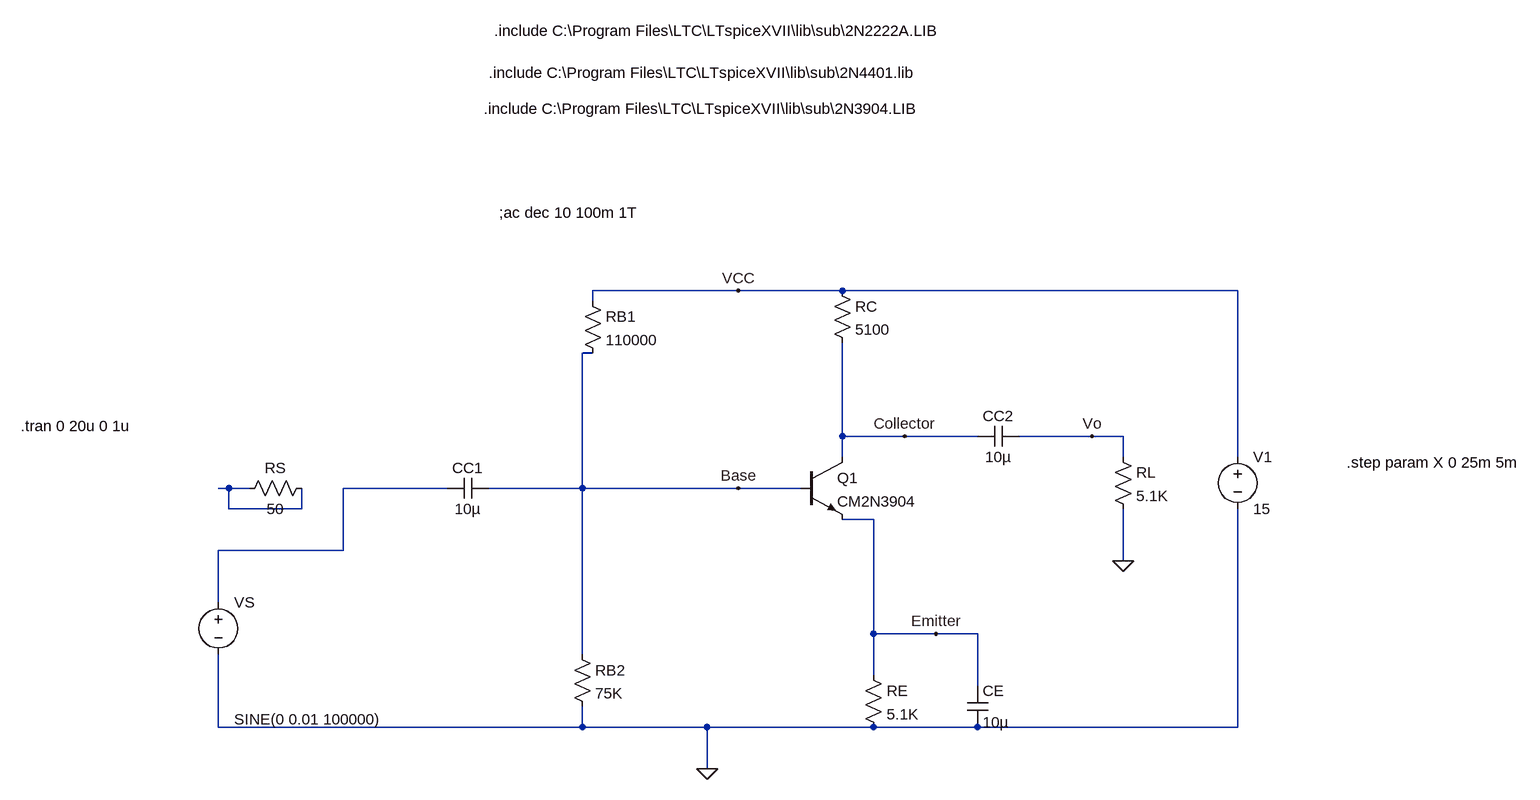
[diagram p0: schematic temp.asc]
temp.asc, the LTspice schematic file:
Version 4
SHEET 1 3216 804
WIRE 288 -16 64 -16
WIRE 448 -16 288 -16
WIRE 1056 -16 448 -16
WIRE 64 0 64 -16
WIRE 64 80 48 80
WIRE 448 208 448 64
WIRE 544 208 448 208
WIRE 656 208 544 208
WIRE 832 208 720 208
WIRE 880 208 832 208
WIRE 448 240 448 208
WIRE 880 240 880 208
WIRE 1056 240 1056 -16
WIRE -496 288 -512 288
WIRE -464 288 -496 288
WIRE -160 288 -320 288
WIRE 48 288 48 80
WIRE 48 288 -96 288
WIRE 288 288 48 288
WIRE 384 288 288 288
WIRE -496 320 -496 288
WIRE -384 320 -384 288
WIRE -384 320 -496 320
WIRE 496 336 448 336
WIRE -320 384 -320 288
WIRE -320 384 -512 384
WIRE 880 400 880 320
WIRE -512 464 -512 384
WIRE 496 512 496 336
WIRE 592 512 496 512
WIRE 656 512 592 512
WIRE 48 544 48 288
WIRE 496 576 496 512
WIRE 656 592 656 512
WIRE -512 656 -512 544
WIRE 48 656 48 624
WIRE 48 656 -512 656
WIRE 240 656 48 656
WIRE 496 656 240 656
WIRE 656 656 496 656
WIRE 1056 656 1056 320
WIRE 1056 656 656 656
WIRE 240 720 240 656
FLAG 240 720 0
FLAG 288 -16 VCC
FLAG 592 512 Emitter
FLAG 880 400 0
FLAG 544 208 Collector
FLAG 288 288 Base
FLAG 832 208 Vo
SYMBOL res 48 -16 R0
SYMATTR InstName RB1
SYMATTR Value 110000
SYMBOL res 432 -32 R0
SYMATTR InstName RC
SYMATTR Value 5100
SYMBOL res 32 528 R0
SYMATTR InstName RB2
SYMATTR Value 75K
SYMBOL npn 384 240 R0
SYMATTR InstName Q1
SYMATTR Value CM2N3904
SYMBOL res 480 560 R0
SYMATTR InstName RE
SYMATTR Value 5.1K
SYMBOL cap -96 272 R90
WINDOW 0 0 32 VBottom 2
WINDOW 3 32 32 VTop 2
SYMATTR InstName CC1
SYMATTR Value 10µ
SYMBOL res -368 272 R90
WINDOW 0 0 56 VBottom 2
WINDOW 3 32 56 VTop 2
SYMATTR InstName RS
SYMATTR Value 50
SYMBOL cap 640 592 R0
SYMATTR InstName CE
SYMATTR Value 10µ
SYMBOL cap 720 192 R90
WINDOW 0 0 32 VBottom 2
WINDOW 3 32 32 VTop 2
SYMATTR InstName CC2
SYMATTR Value 10µ
SYMBOL res 864 224 R0
SYMATTR InstName RL
SYMATTR Value 5.1K
SYMBOL voltage -512 448 R0
WINDOW 3 24 196 Left 2
WINDOW 123 24 66 Left 2
WINDOW 39 0 0 Left 0
SYMATTR Value SINE(0 0.01 100000)
SYMATTR InstName VS
SYMBOL voltage 1056 224 R0
WINDOW 123 0 0 Left 0
WINDOW 39 0 0 Left 0
SYMATTR InstName V1
SYMATTR Value 15
TEXT -104 -296 Left 2 !.include C:\\Program Files\\LTC\\LTspiceXVII\\lib\\sub\\2N3904.LIB
TEXT -96 -352 Left 2 !.include C:\\Program Files\\LTC\\LTspiceXVII\\lib\\sub\\2N4401.lib
TEXT -88 -416 Left 2 !.include C:\\Program Files\\LTC\\LTspiceXVII\\lib\\sub\\2N2222A.LIB
TEXT -80 -136 Left 2 !;ac dec 10 100m 1T
TEXT -816 192 Left 2 !.tran 0 20u 0 1u
TEXT 1224 248 Left 2 !.step param X 0 25m 5m

The netlist it stands for:
* temp.asc
RB1 VCC Base 110000
RC VCC Collector 5100
RB2 Base 0 75K
Q1 Collector Base Emitter 0 CM2N3904
RE Emitter 0 5.1K
CC1 Base N002 10µ
RS N001 N001 50
CE Emitter 0 10µ
CC2 Vo Collector 10µ
RL Vo 0 5.1K
VS N002 0 SINE(0 0.01 100000)
V1 VCC 0 15
.model NPN NPN
.model PNP PNP
.lib standard.bjt
.include C:\Program Files\LTC\LTspiceXVII\lib\sub\2N3904.LIB
.include C:\Program Files\LTC\LTspiceXVII\lib\sub\2N4401.lib
.include C:\Program Files\LTC\LTspiceXVII\lib\sub\2N2222A.LIB
;ac dec 10 100m 1T
.tran 0 20u 0 1u
.step param X 0 25m 5m
.backanno
.end